# EAGLE design 8PinPortConnectorOffset v1 (EAGLE 9.7.0)
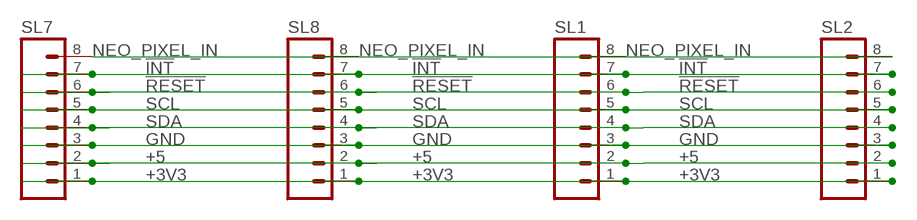
[diagram p0: schematic, sheet 1]

## Parts
SL1  MA08  [08PA]
SL2  MA08  [08PA]
SL7  MA08  [08PA]
SL8  MA08  [08PA]

## Nets
!INT: SL1.7 SL2.7 SL7.7 SL8.7
!RESET: SL1.6 SL2.6 SL7.6 SL8.6
+3V3: SL1.1 SL2.1 SL7.1 SL8.1
+5: SL1.2 SL2.2 SL7.2 SL8.2
GND: SL1.3 SL2.3 SL7.3 SL8.3
NEO_PIXEL_IN: SL1.8 SL2.8 SL7.8 SL8.8
SCL: SL1.5 SL2.5 SL7.5 SL8.5
SDA: SL1.4 SL2.4 SL7.4 SL8.4

## Library data of the parts
SL1 SL2 SL7 SL8 = con-amp-quick:MA08: AMP QUICK CONNECTOR; OC_FARNELL: unknown; OC_NEWARK: unknown

## Board
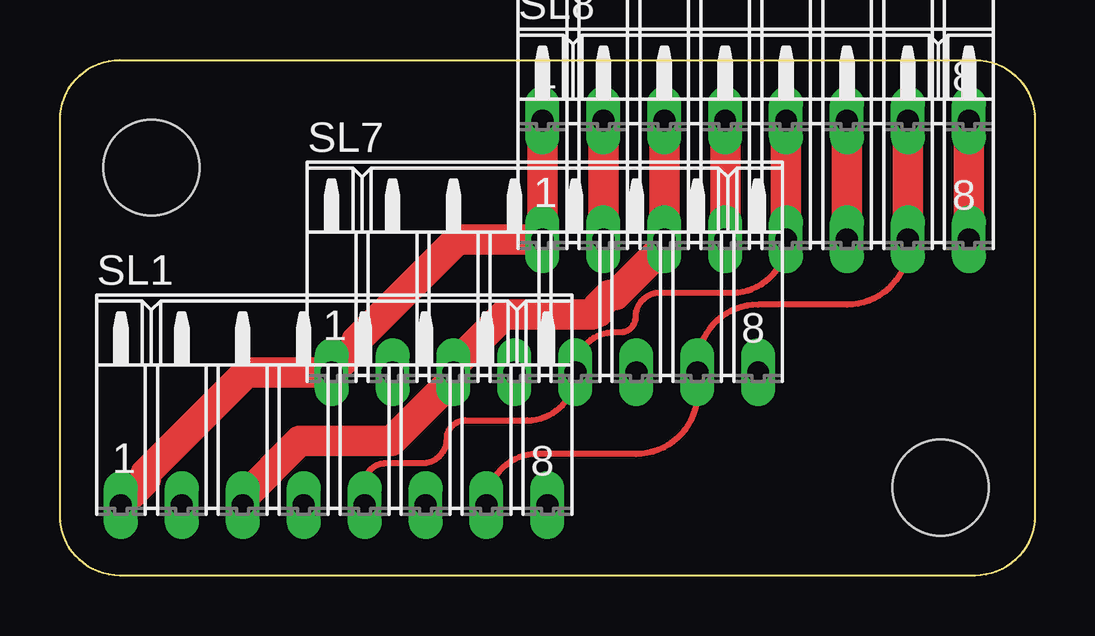
[diagram p1: board, top side]
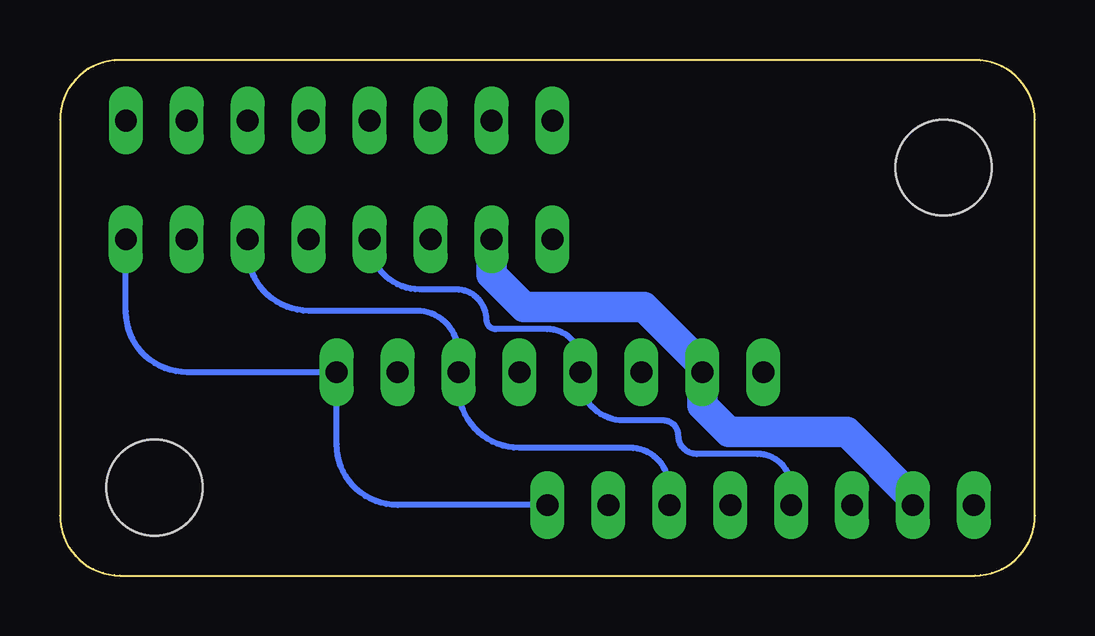
[diagram p2: board, bottom side, seen from below]

Size 40.64 x 21.5 mm. Coordinates in mm from the lower left corner, seen from the top.
Outline: 38.14,0 2.5,0 arc-90 0,2.5 0,19 arc-90 2.5,21.5 38.14,21.5 arc-90 40.64,19 40.64,2.5 arc-90 38.14,0
Copper layers (1*16): Top 0.035mm / dielectric 1.5mm / Bottom 0.035mm
Design rules "Fusion Electronics Design Rules": minimum track width 6mil, minimum drill 0.35mm, track to track 6mil, track to pad 6mil, pad to pad 6mil, via to via 6mil, smd to smd 6mil, copper to edge 40mil, drill to drill 6mil, minimum pad ring 10mil, minimum via ring 8mil, stop-mask expansion 4mil, vias tented up to drill 9999mil, thermal gap 10mil
Holes 4 mm at 3.81,17.01 36.7,3.67

### Footprints (pad centres in the part's own frame; a part is rotated, then mirrored left to right if it is on the bottom)
08PA = drill 0.914 long: 1 -8.89,0; 2 -6.35,0; 3 -3.81,0; 4 -1.27,0; 5 1.27,0; 6 3.81,0; 7 6.35,0; 8 8.89,0

### Placement (x,y rotation side)
SL1  11.43,2.94 0 top
SL2  29,18.97 0 top
SL7  20.22,8.48 0 top
SL8  29,14.02 0 top

### Tracks (layer width: path | path; a pad name or v marks a point on that pad's centre or on a via)
!INT
  Top 0.254: SL8.7 35.35,13.84 arc-90 32.81,11.29 29.11,11.29 arc90 26.57,8.76 SL7.7 26.57,7.61 arc-90 24.02,5.07 19.91,5.07 arc90 SL1.7
  Top 1.27: SL2.7 | SL2.7 SL8.7
!RESET
  Top 1.27: SL2.6 | SL2.6 SL8.6
  Bottom 0.254: SL1.6 15.24,3.67 arc-90 16.89,5.33 21.48,5.33 arc90 24.02,7.87 SL7.6 24.02,9.29 arc-90 25.78,11.04 30.27,11.04 arc90 32.81,13.58 SL8.6
+3V3
  Top 1.27: SL1.1 3.58,3.98 3.58,4.27 7.79,8.48 SL7.1 12.37,9.52 12.37,9.81 16.57,14.02 SL8.1 SL2.1 | SL2.1
+5
  Top 1.27: SL2.2 | SL2.2 SL8.2
  Bottom 1.27: SL8.2 22.65,12.54 21.3,11.19 16.29,11.19 13.87,8.77 SL7.2 13.87,7.1 12.75,5.99 7.84,5.99 5.08,3.23 SL1.2
GND
  Top 1.27: SL1.3 7.62,3.23 10,5.61 13.82,5.61 16.41,8.19 SL7.3 16.41,8.77 18.53,10.89 22.19,10.89 22.45,10.99 22.45,11.24 22.91,11.7 23.16,11.7 25.19,13.73 SL8.3 SL2.3 | SL2.3
NEO_PIXEL_IN
  Top 1.27: SL2.8 | SL2.8 SL8.8
  Bottom 0.254: SL1.8 26.57,2.94 arc90 29.11,5.48 SL7.8 35.35,8.48 arc90 37.89,11.02 SL8.8
SCL
  Top 0.254: SL1.5 12.7,3.8 arc-90 13.59,4.69 15.11,4.69 arc90 16.13,5.71 arc-90 16.89,6.47 19.48,6.47 arc90 SL7.5 21.48,8.52 arc-90 23.11,10.15 23.37,10.15 arc90 24,10.79 arc-90 25.02,11.8 28.05,11.8 arc90 SL8.5
  Top 1.27: SL2.5 | SL2.5 SL8.5
SDA
  Top 1.27: SL2.4 | SL2.4 SL8.4
  Bottom 0.254: SL8.4 arc-90 25.64,11.93 24.13,11.93 arc90 22.86,10.66 arc-90 22.48,10.28 20.32,10.28 arc90 18.95,8.9 SL7.4 18.95,8.27 arc-90 17.14,6.47 15.49,6.47 arc90 14.86,5.83 arc-90 14.1,5.07 11.56,5.07 arc90 10.16,3.67 SL1.4